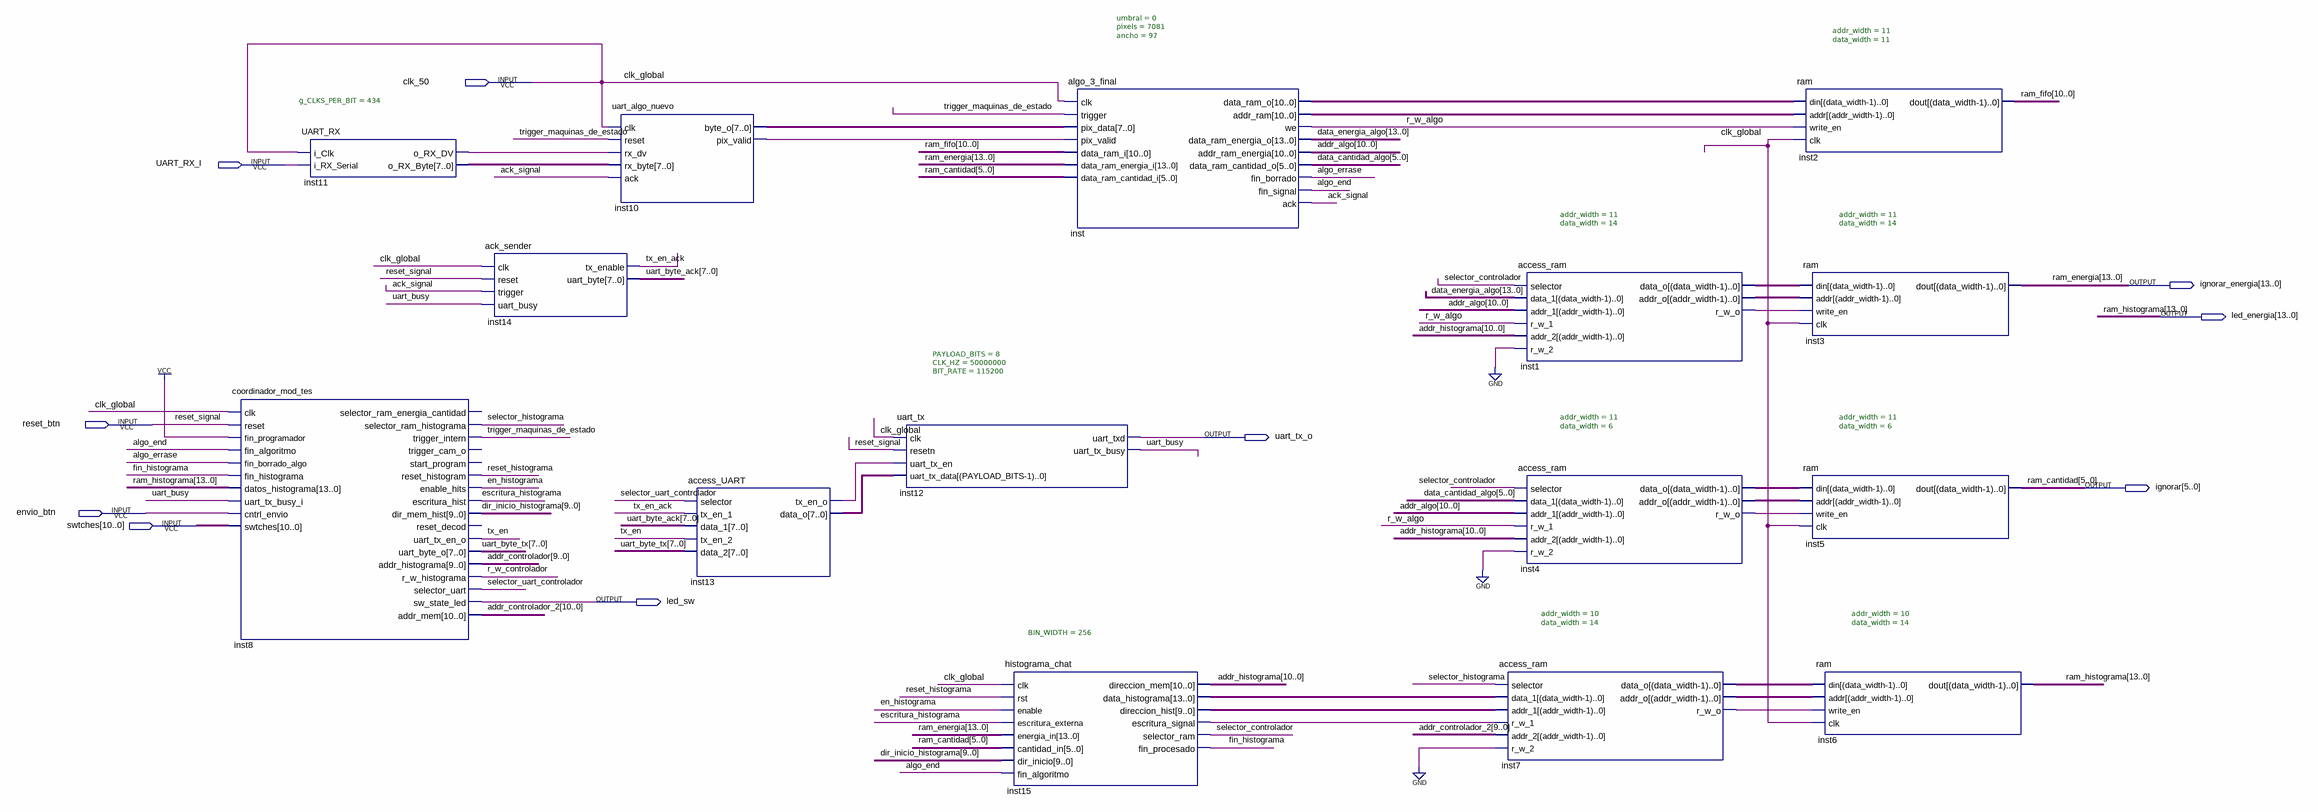
[diagram p0: schematic sheet]
// Quartus schematic test_sistema_completo_uart.bdf as structural Verilog: 15 symbols, 10 pins
module test_sistema_completo_uart (
  input  clk_50,
  input  UART_RX_I,
  input  reset_btn,
  input  envio_btn,
  input  [10:0] swtches,
  output [13:0] ignorar_energia,
  output [13:0] led_energia,
  output uart_tx_o,
  output [5:0] ignorar,
  output led_sw
);

  wire ack_signal, algo_end, algo_errase, en_histograma, escritura_histograma, fin_histograma, inst1_r_w_o,
       inst4_r_w_o, inst7_r_w_o, inst10_pix_valid, inst11_o_rx_dv, inst13_tx_en_o, inst15_escritura_signal,
       r_w_algo, r_w_controlador, reset_histograma, selector_controlador, selector_histograma,
       selector_uart_controlador, trigger_maquinas_de_estado, tx_en, tx_en_ack, uart_busy;
  wire [5:0] data_cantidad_algo, inst4_data_o;
  wire [7:0] inst10_byte_o, inst11_o_rx_byte, inst13_data_o, uart_byte_ack, uart_byte_tx;
  wire [9:0] addr_controlador, dir_inicio_histograma, inst7_addr_o, inst15_direccion_hist;
  wire [10:0] addr_algo, addr_controlador_2, addr_histograma, inst1_addr_o, inst4_addr_o, inst_addr_ram,
       inst_data_ram_o, ram_fifo;
  wire [13:0] data_energia_algo, inst1_data_o, inst7_data_o, inst15_data_histograma;

  coordinador_mod_tes inst8 (
    .clk(clk_50), .reset(reset_btn), .fin_programador(1'b1), .fin_algoritmo(algo_end),
    .fin_borrado_algo(algo_errase), .fin_histograma(fin_histograma), .datos_histograma(led_energia),
    .uart_tx_busy_i(uart_busy), .cntrl_envio(envio_btn), .swtches(swtches),
    .selector_ram_histograma(selector_histograma), .trigger_intern(trigger_maquinas_de_estado),
    .reset_histogram(reset_histograma), .enable_hits(en_histograma), .escritura_hist(escritura_histograma),
    .dir_mem_hist(dir_inicio_histograma), .uart_tx_en_o(tx_en), .uart_byte_o(uart_byte_tx),
    .addr_histograma(addr_controlador), .r_w_histograma(r_w_controlador),
    .selector_uart(selector_uart_controlador), .sw_state_led(led_sw), .addr_mem(addr_controlador_2));  // open: selector_ram_energia_cantidad, trigger_cam_o, start_program, reset_decod
  UART_RX #(.g_CLKS_PER_BIT(434)) inst11 (
    .i_Clk(clk_50), .i_RX_Serial(UART_RX_I), .o_RX_DV(inst11_o_rx_dv), .o_RX_Byte(inst11_o_rx_byte));
  ack_sender inst14 (
    .clk(clk_50), .reset(reset_btn), .trigger(ack_signal), .uart_busy(uart_busy), .tx_enable(tx_en_ack),
    .uart_byte(uart_byte_ack));
  uart_algo_nuevo inst10 (
    .clk(clk_50), .reset(trigger_maquinas_de_estado), .rx_dv(inst11_o_rx_dv), .rx_byte(inst11_o_rx_byte),
    .ack(ack_signal), .byte_o(inst10_byte_o), .pix_valid(inst10_pix_valid));
  access_UART inst13 (
    .selector(selector_uart_controlador), .tx_en_1(tx_en_ack), .data_1(uart_byte_ack), .tx_en_2(tx_en),
    .data_2(uart_byte_tx), .tx_en_o(inst13_tx_en_o), .data_o(inst13_data_o));
  uart_tx #(.PAYLOAD_BITS(8), .CLK_HZ(50000000), .BIT_RATE(115200)) inst12 (
    .clk(clk_50), .resetn(reset_btn), .uart_tx_en(inst13_tx_en_o), .uart_tx_data(inst13_data_o),
    .uart_txd(uart_tx_o), .uart_tx_busy(uart_busy));
  histograma_chat #(.BIN_WIDTH(256)) inst15 (
    .clk(clk_50), .rst(reset_histograma), .enable(en_histograma), .escritura_externa(escritura_histograma),
    .energia_in(ignorar_energia), .cantidad_in(ignorar), .dir_inicio(dir_inicio_histograma),
    .fin_algoritmo(algo_end), .direccion_mem(addr_histograma), .data_histograma(inst15_data_histograma),
    .direccion_hist(inst15_direccion_hist), .escritura_signal(inst15_escritura_signal),
    .selector_ram(selector_controlador), .fin_procesado(fin_histograma));
  algo_3_final #(.umbral(0), .pixels(7081), .ancho(97)) inst (
    .clk(clk_50), .trigger(trigger_maquinas_de_estado), .pix_data(inst10_byte_o),
    .pix_valid(inst10_pix_valid), .data_ram_i(ram_fifo), .data_ram_energia_i(ignorar_energia),
    .data_ram_cantidad_i(ignorar), .data_ram_o(inst_data_ram_o), .addr_ram(inst_addr_ram), .we(r_w_algo),
    .data_ram_energia_o(data_energia_algo), .addr_ram_energia(addr_algo),
    .data_ram_cantidad_o(data_cantidad_algo), .fin_borrado(algo_errase), .fin_signal(algo_end),
    .ack(ack_signal));
  access_ram #(.addr_width(10), .data_width(14)) inst7 (
    .selector(selector_histograma), .data_1(inst15_data_histograma), .addr_1(inst15_direccion_hist),
    .r_w_1(inst15_escritura_signal), .addr_2(addr_controlador_2[9:0]), .r_w_2(1'b0), .data_o(inst7_data_o),
    .addr_o(inst7_addr_o), .r_w_o(inst7_r_w_o));
  access_ram #(.addr_width(11), .data_width(14)) inst1 (
    .selector(selector_controlador), .data_1(data_energia_algo), .addr_1(addr_algo), .r_w_1(r_w_algo),
    .addr_2(addr_histograma), .r_w_2(1'b0), .data_o(inst1_data_o), .addr_o(inst1_addr_o), .r_w_o(inst1_r_w_o));
  access_ram #(.addr_width(11), .data_width(6)) inst4 (
    .selector(selector_controlador), .data_1(data_cantidad_algo), .addr_1(addr_algo), .r_w_1(r_w_algo),
    .addr_2(addr_histograma), .r_w_2(1'b0), .data_o(inst4_data_o), .addr_o(inst4_addr_o), .r_w_o(inst4_r_w_o));
  ram #(.addr_width(11), .data_width(11)) inst2 (
    .din(inst_data_ram_o), .addr(inst_addr_ram), .write_en(r_w_algo), .clk(clk_50), .dout(ram_fifo));
  ram #(.addr_width(11), .data_width(14)) inst3 (
    .din(inst1_data_o), .addr(inst1_addr_o), .write_en(inst1_r_w_o), .clk(clk_50), .dout(ignorar_energia));
  ram #(.addr_width(11), .data_width(6)) inst5 (
    .din(inst4_data_o), .addr(inst4_addr_o), .write_en(inst4_r_w_o), .clk(clk_50), .dout(ignorar));
  ram #(.addr_width(10), .data_width(14)) inst6 (
    .din(inst7_data_o), .addr(inst7_addr_o), .write_en(inst7_r_w_o), .clk(clk_50), .dout(led_energia));

  // Other names for the same wires on the sheet: clk_global = clk_50; ram_cantidad[5:0] = ignorar;
  //   ram_energia[13:0] = ignorar_energia; ram_histograma[13:0] = led_energia; reset_signal = reset_btn
endmodule
